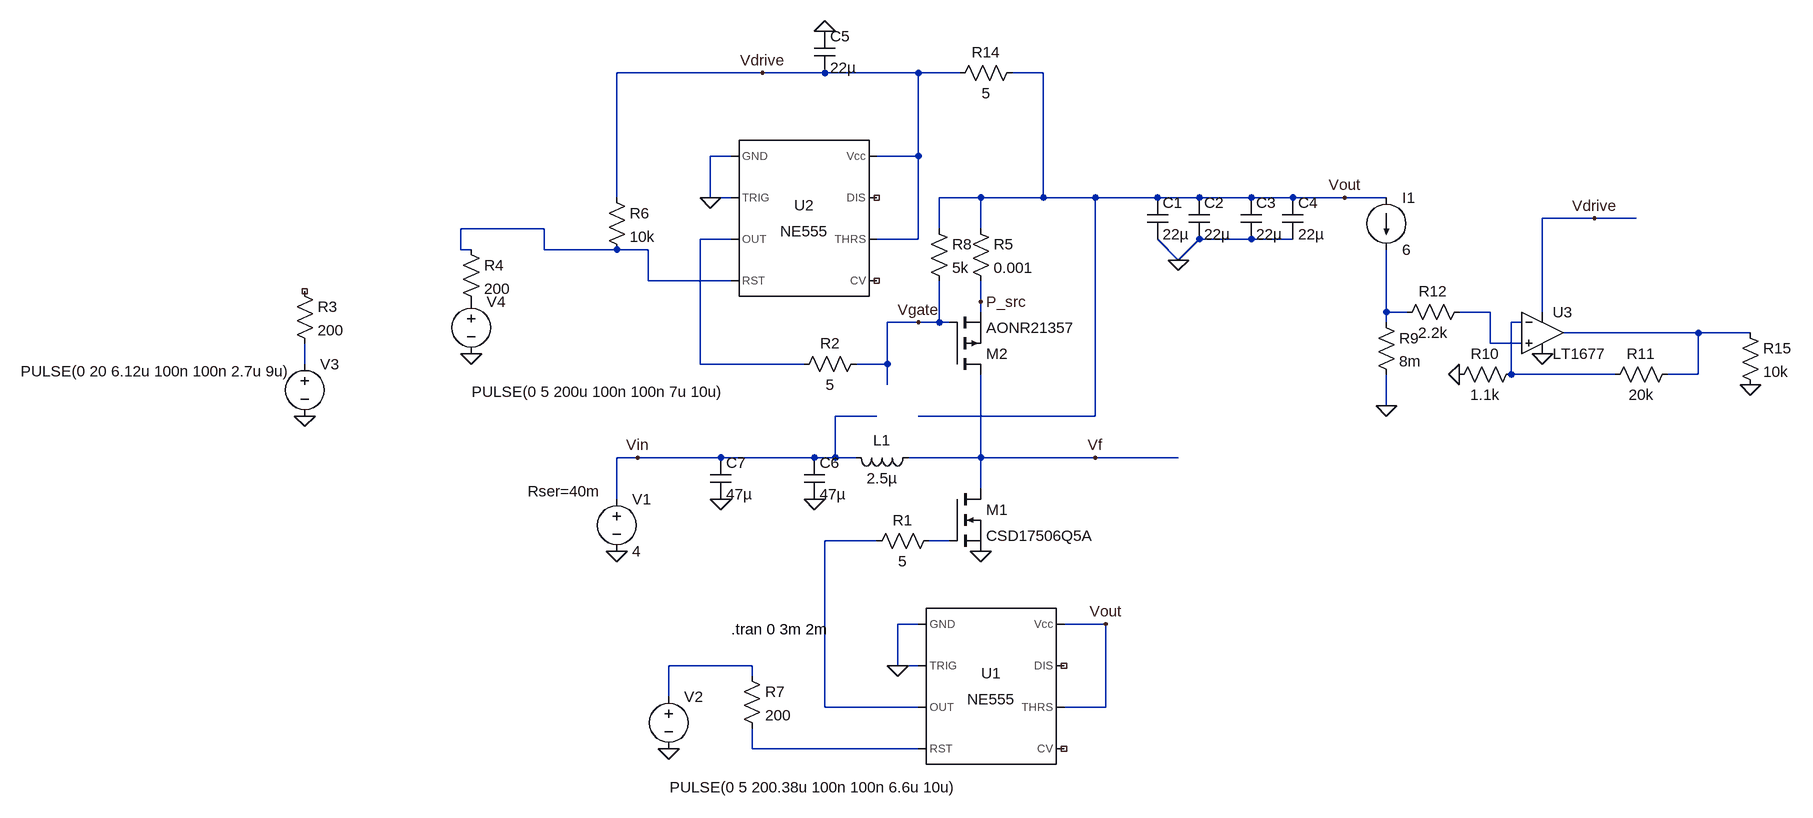
[diagram p0: schematic boost 1s.asc]
boost 1s.asc, the LTspice schematic file:
Version 4
SHEET 1 1668 680
WIRE 80 -496 -144 -496
WIRE 176 -496 80 -496
WIRE 320 -496 176 -496
WIRE 384 -496 320 -496
WIRE 512 -496 464 -496
WIRE 32 -368 0 -368
WIRE 320 -368 320 -496
WIRE 320 -368 256 -368
WIRE -144 -304 -144 -496
WIRE 0 -304 0 -368
WIRE 32 -304 0 -304
WIRE 416 -304 352 -304
WIRE 512 -304 512 -496
WIRE 512 -304 416 -304
WIRE 592 -304 512 -304
WIRE 688 -304 592 -304
WIRE 752 -304 688 -304
WIRE 832 -304 752 -304
WIRE 896 -304 832 -304
WIRE 976 -304 896 -304
WIRE 1040 -304 976 -304
WIRE 1360 -272 1280 -272
WIRE 1424 -272 1360 -272
WIRE -256 -256 -384 -256
WIRE 352 -256 352 -304
WIRE 416 -256 416 -304
WIRE 32 -240 -16 -240
WIRE 320 -240 320 -368
WIRE 320 -240 256 -240
WIRE 832 -240 752 -240
WIRE 896 -240 832 -240
WIRE -384 -224 -384 -256
WIRE -368 -224 -384 -224
WIRE -256 -224 -256 -256
WIRE -144 -224 -256 -224
WIRE -96 -224 -144 -224
WIRE 720 -208 688 -240
WIRE 720 -208 752 -240
WIRE -96 -176 -96 -224
WIRE 32 -176 -96 -176
WIRE 416 -144 416 -176
WIRE 416 -128 416 -144
WIRE 1040 -128 1040 -224
WIRE 1072 -128 1040 -128
WIRE 1200 -128 1152 -128
WIRE 1280 -128 1280 -272
WIRE 320 -112 272 -112
WIRE 352 -112 352 -176
WIRE 352 -112 320 -112
WIRE 368 -112 352 -112
WIRE 1040 -112 1040 -128
WIRE 1248 -112 1232 -112
WIRE 1520 -96 1312 -96
WIRE 1600 -96 1520 -96
WIRE 1200 -80 1200 -128
WIRE 1248 -80 1200 -80
WIRE -624 -48 -624 -80
WIRE -16 -48 -16 -240
WIRE 144 -48 -16 -48
WIRE 272 -48 272 -112
WIRE 272 -48 224 -48
WIRE 1232 -32 1232 -112
WIRE 1392 -32 1232 -32
WIRE 1520 -32 1520 -96
WIRE 1520 -32 1472 -32
WIRE 272 -16 272 -48
WIRE 1040 16 1040 -32
WIRE 256 32 192 32
WIRE 592 32 592 -304
WIRE 592 32 320 32
WIRE -112 96 -144 96
WIRE 16 96 -112 96
WIRE 160 96 16 96
WIRE 192 96 192 32
WIRE 192 96 160 96
WIRE 224 96 192 96
WIRE 416 96 416 -32
WIRE 416 96 304 96
WIRE 592 96 416 96
WIRE 720 96 592 96
WIRE 416 144 416 96
WIRE -144 160 -144 96
WIRE 256 224 176 224
WIRE 368 224 336 224
WIRE 320 352 288 352
WIRE 608 352 544 352
WIRE 64 416 -64 416
WIRE 288 416 288 352
WIRE 320 416 288 416
WIRE 64 432 64 416
WIRE -64 464 -64 416
WIRE 176 480 176 224
WIRE 320 480 176 480
WIRE 608 480 608 352
WIRE 608 480 544 480
WIRE 64 544 64 512
WIRE 320 544 64 544
FLAG -144 240 0
FLAG 720 -208 0
FLAG 416 240 0
FLAG 1040 16 0
FLAG 16 160 0
FLAG 160 160 0
FLAG 976 -304 Vout
FLAG 608 352 Vout
FLAG 288 416 0
FLAG -64 544 0
FLAG -624 32 0
FLAG 592 96 Vf
FLAG 0 -304 0
FLAG -368 -64 0
FLAG 320 -112 Vgate
FLAG 416 -144 P_src
FLAG -112 96 Vin
FLAG 1152 -32 0
FLAG 1280 -64 0
FLAG 176 -560 0
FLAG 80 -496 Vdrive
FLAG 1600 -16 0
FLAG 1360 -272 Vdrive
SYMBOL voltage -144 144 R0
WINDOW 123 0 0 Left 0
WINDOW 39 -137 4 Left 2
SYMATTR SpiceLine Rser=40m
SYMATTR InstName V1
SYMATTR Value 4
SYMBOL ind 320 80 R90
WINDOW 0 5 56 VBottom 2
WINDOW 3 32 56 VTop 2
SYMATTR InstName L1
SYMATTR Value 2.5µ
SYMATTR SpiceLine Ipk=25.5 Rser=0.00402 Rpar=0 Cpar=0
SYMBOL nmos 368 144 R0
SYMATTR InstName M1
SYMATTR Value CSD17506Q5A
SYMBOL voltage -64 448 R0
WINDOW 3 1 155 Left 2
WINDOW 123 0 0 Left 0
WINDOW 39 0 0 Left 0
SYMATTR Value PULSE(0 5 200.38u 100n 100n 6.6u 10u)
SYMATTR InstName V2
SYMBOL res 352 208 R90
WINDOW 0 0 56 VBottom 2
WINDOW 3 32 56 VTop 2
SYMATTR InstName R1
SYMATTR Value 5
SYMBOL cap 672 -304 R0
SYMATTR InstName C1
SYMATTR Value 22µ
SYMATTR SpiceLine V=16 Irms=13.8 Rser=0.00468332 Lser=0
SYMBOL cap 736 -304 R0
SYMATTR InstName C2
SYMATTR Value 22µ
SYMATTR SpiceLine V=16 Irms=13.8 Rser=0.00468332 Lser=0
SYMBOL cap 816 -304 R0
SYMATTR InstName C3
SYMATTR Value 22µ
SYMATTR SpiceLine V=16 Irms=13.8 Rser=0.00468332 Lser=0
SYMBOL cap 880 -304 R0
SYMATTR InstName C4
SYMATTR Value 22µ
SYMATTR SpiceLine V=16 Irms=13.8 Rser=0.00468332 Lser=0
SYMBOL voltage -624 -64 R0
WINDOW 3 -437 27 Left 2
WINDOW 123 0 0 Left 0
WINDOW 39 0 0 Left 0
SYMATTR Value PULSE(0 20 6.12u 100n 100n 2.7u 9u)
SYMATTR InstName V3
SYMBOL cap 0 96 R0
SYMATTR InstName C7
SYMATTR Value 47µ
SYMATTR SpiceLine V=16 Irms=0 Rser=0.00225907 Lser=900p mfg="Würth Elektronik" pn="885012109011 WCAP-CSGP 1210" type="X5R"
SYMBOL cap 144 96 R0
SYMATTR InstName C6
SYMATTR Value 47µ
SYMATTR SpiceLine V=16 Irms=0 Rser=0.00225907 Lser=900p mfg="Würth Elektronik" pn="885012109011 WCAP-CSGP 1210" type="X5R"
SYMBOL Misc\\NE555 432 448 R0
SYMATTR InstName U1
SYMBOL res -640 -176 R0
SYMATTR InstName R3
SYMATTR Value 200
SYMBOL pmos 368 -32 M180
SYMATTR InstName M2
SYMATTR Value AONR21357
SYMBOL Misc\\NE555 144 -272 R0
SYMATTR InstName U2
SYMBOL res 240 -64 R90
WINDOW 0 0 56 VBottom 2
WINDOW 3 32 56 VTop 2
SYMATTR InstName R2
SYMATTR Value 5
SYMBOL voltage -368 -160 R0
WINDOW 3 1 155 Left 2
WINDOW 123 0 0 Left 0
WINDOW 39 0 0 Left 0
SYMATTR Value PULSE(0 5 200u 100n 100n 7u 10u)
SYMATTR InstName V4
SYMBOL res -384 -240 R0
SYMATTR InstName R4
SYMATTR Value 200
SYMBOL res 400 -272 R0
SYMATTR InstName R5
SYMATTR Value 0.001
SYMBOL res 48 416 R0
SYMATTR InstName R7
SYMATTR Value 200
SYMBOL res 336 -272 R0
SYMATTR InstName R8
SYMATTR Value 5k
SYMBOL res -160 -320 R0
SYMATTR InstName R6
SYMATTR Value 10k
SYMBOL res 1024 -128 R0
SYMATTR InstName R9
SYMATTR Value 8m
SYMBOL OpAmps\\LT1677 1280 -160 R0
SYMATTR InstName U3
SYMBOL res 1248 -48 R90
WINDOW 0 0 56 VBottom 2
WINDOW 3 32 56 VTop 2
SYMATTR InstName R10
SYMATTR Value 1.1k
SYMBOL res 1488 -48 R90
WINDOW 0 0 56 VBottom 2
WINDOW 3 32 56 VTop 2
SYMATTR InstName R11
SYMATTR Value 20k
SYMBOL res 1168 -144 R90
WINDOW 0 0 56 VBottom 2
WINDOW 3 32 56 VTop 2
SYMATTR InstName R12
SYMATTR Value 2.2k
SYMBOL cap 160 -560 R0
SYMATTR InstName C5
SYMATTR Value 22µ
SYMBOL res 480 -512 R90
WINDOW 0 0 56 VBottom 2
WINDOW 3 32 56 VTop 2
SYMATTR InstName R14
SYMATTR Value 5
SYMBOL res 1584 -112 R0
SYMATTR InstName R15
SYMATTR Value 10k
SYMBOL current 1040 -304 R0
WINDOW 123 0 0 Left 0
WINDOW 39 0 0 Left 0
SYMATTR InstName I1
SYMATTR Value 6
TEXT 32 360 Left 2 !.tran 0 3m 2m

The netlist it stands for:
* boost 1s.asc
V1 Vin 0 4 Rser=40m
L1 Vf Vin 2.5µ Ipk=25.5 Rser=0.00402 Rpar=0 Cpar=0
M1 Vf N009 0 0 CSD17506Q5A
V2 N010 0 PULSE(0 5 200.38u 100n 100n 6.6u 10u)
R1 N009 N008 5
C1 Vout 0 22µ V=16 Irms=13.8 Rser=0.00468332 Lser=0
C2 Vout 0 22µ V=16 Irms=13.8 Rser=0.00468332 Lser=0
C3 Vout 0 22µ V=16 Irms=13.8 Rser=0.00468332 Lser=0
C4 Vout 0 22µ V=16 Irms=13.8 Rser=0.00468332 Lser=0
V3 N007 0 PULSE(0 20 6.12u 100n 100n 2.7u 9u)
C7 Vin 0 47µ V=16 Irms=0 Rser=0.00225907 Lser=900p mfg="Würth Elektronik" pn="885012109011 WCAP-CSGP 1210" type="X5R"
C6 Vin 0 47µ V=16 Irms=0 Rser=0.00225907 Lser=900p mfg="Würth Elektronik" pn="885012109011 WCAP-CSGP 1210" type="X5R"
XU1 0 0 N008 N011 NC_01 Vout NC_02 Vout NE555  ; pins GND TRIG OUT RST CV THRS DIS Vcc
R3 NC_03 N007 200
M2 Vf Vgate P_src P_src AONR21357
XU2 0 0 N002 N001 NC_04 Vdrive NC_05 Vdrive NE555  ; pins GND TRIG OUT RST CV THRS DIS Vcc
R2 Vgate N002 5
V4 P001 0 PULSE(0 5 200u 100n 100n 7u 10u)
R4 N001 P001 200
R5 Vout P_src 0.001
R7 N010 N011 200
R8 Vout Vgate 5k
R6 Vdrive N001 10k
R9 N003 0 8m
XU3 N004 N005 Vdrive 0 N006 LT1677  ; pins In+ In- V+ V- OUT
R10 N005 0 1.1k
R11 N006 N005 20k
R12 N004 N003 2.2k
C5 0 Vdrive 22µ
R14 Vout Vdrive 5
R15 N006 0 10k
I1 Vout N003 6
.model NMOS NMOS
.model PMOS PMOS
.lib standard.mos
.tran 0 3m 2m
.lib NE555.sub
.lib LTC.lib
.backanno
.end